# Altium schematic sheet AMPiso.SchDoc
size 420 x 297 mm; Address1: Address1; Address2: Address2; Address3: Address3; Address4: Address4; SheetNumber: 1; Scale: 1:1; Разраб.: Иванов; Обозначение документа: АБВГ.123456.001 Э3; Пров.: Петров; Утв.: Сидоров; Наименование организации: ОАО "Концерн "МПО-Гидроприбор"; Перв. применение: АБВГ.123456.000; Наименование изделия 1: Плата; Наименование изделия 2: Схема электрическая; Наименование изделия 3: принципиальная; Нач. отд.: Нач. отд.; Фамилия нач. отд.: Сидоров
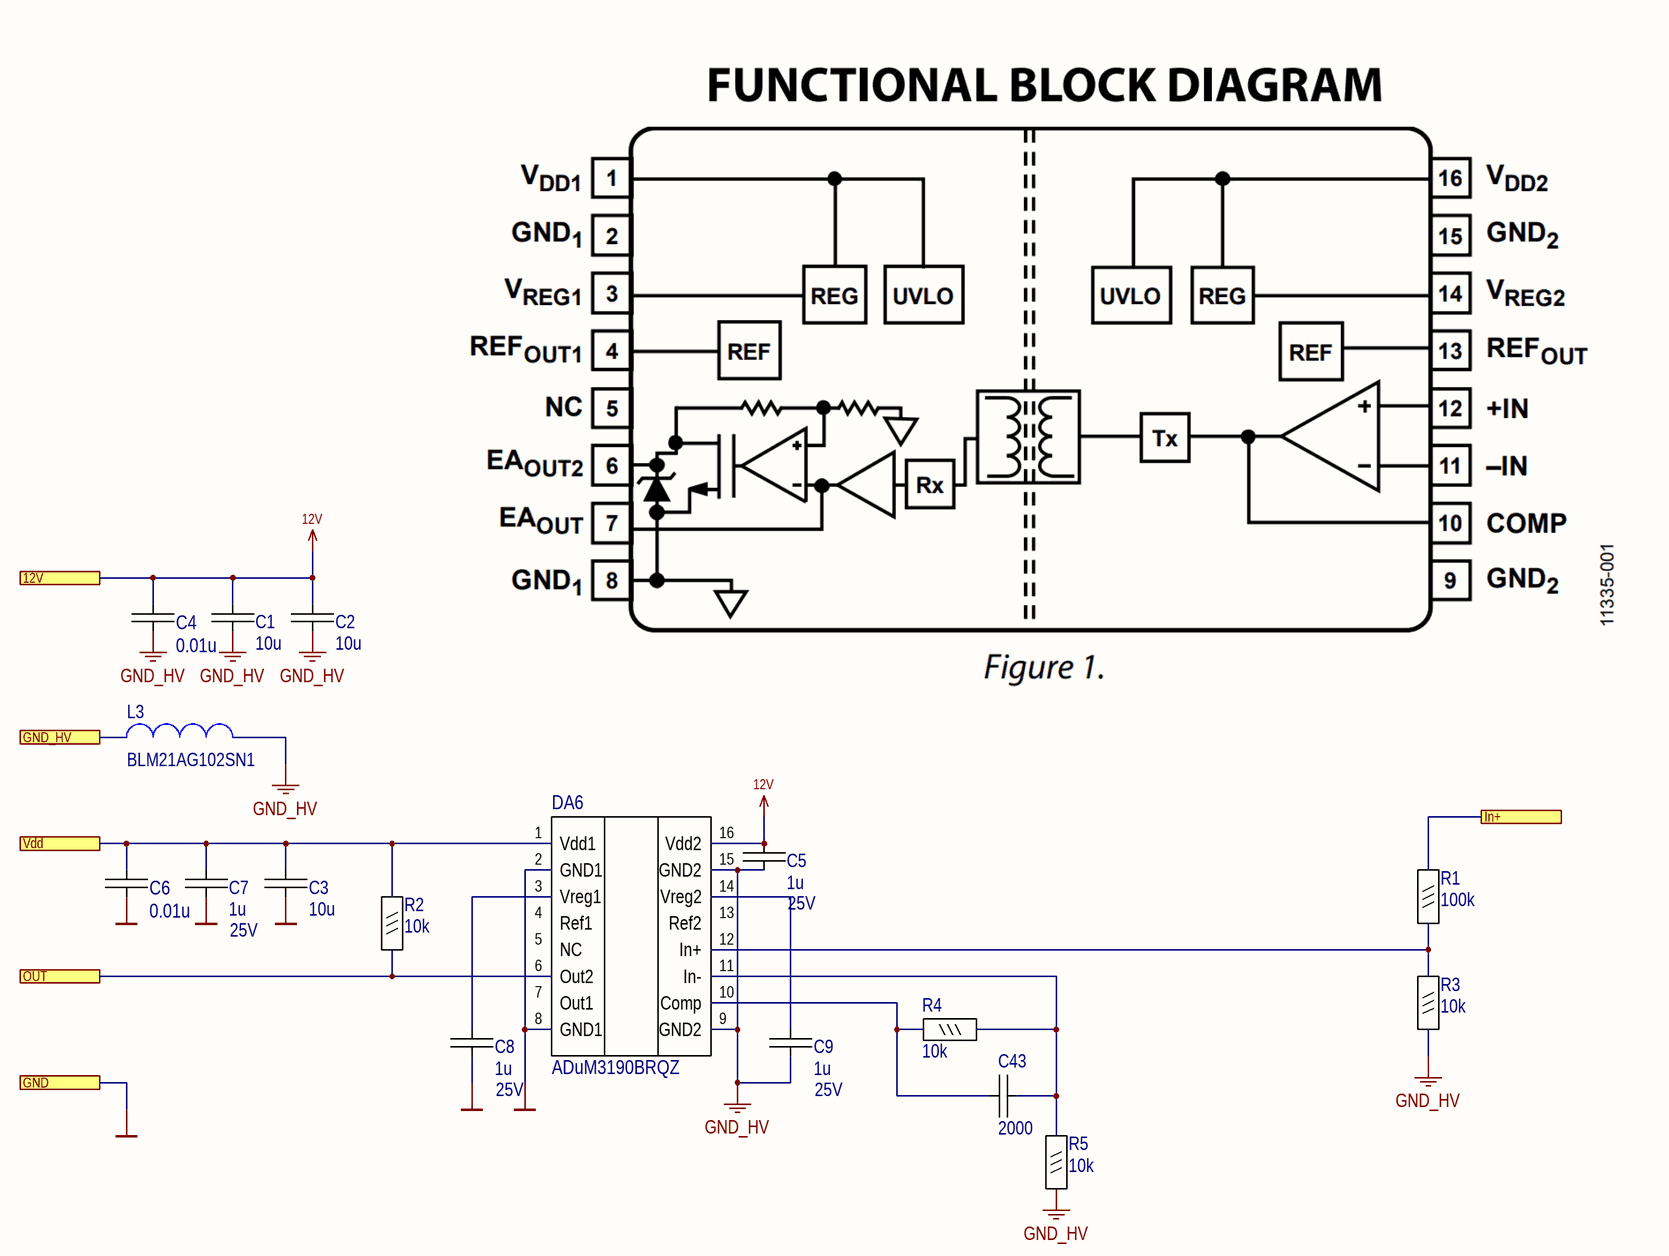
[diagram p0: AMPiso.SchDoc]

## Parts
C1  10u  [C0805_IPC]
C2  10u  [C0805_IPC]
C3  10u  [C0805_IPC]
C4  0.01u  [C0603_IPC]
C5  1u  Voltage/Power: 25V  [C0603_IPC]
C6  0.01u  [C0603_IPC]
C7  1u  Voltage/Power: 25V  [C0603_IPC]
C8  1u  Voltage/Power: 25V  [C0603_IPC]
C9  1u  Voltage/Power: 25V  [C0603_IPC]
C43  2000  [C0603_IPC]
DA6  ADuM3190BRQZ  [QSOP16]
L3  BLM21AG102SN1  [ind0805]
R1  100k  [R0603]
R2  10k  [R0603]
R3  10k  [R0603]
R4  10k  [R0603]
R5  10k  [R0603]

## Ports
12V, GND, GND_HV, In+, OUT, Vdd

## Nets
12V: C1.1 C2.1 C4.1 C5.1 DA6.16(Vdd2) ; port 12V
GND: C3.2 C6.2 C7.2 C8.2 DA6.2(GND1) DA6.8(GND1) ; port GND
GND_HV: C1.2 C2.2 C4.2 C5.2 C9.2 DA6.9(GND2) DA6.15(GND2) L3.2 R3.1 R5.1
GND_HV: L3.1 ; port GND_HV  [a separate net that carries the same name]
In+: R1.2 ; port In+
OUT: DA6.6(Out2) R2.1 ; port OUT
Vdd: C3.1 C6.1 C7.1 DA6.1(Vdd1) R2.2 ; port Vdd
NetC8_1: C8.1 DA6.3(Vreg1)
NetC9_1: C9.1 DA6.14(Vreg2)
NetC43_1: C43.1 DA6.10(Comp) R4.1
NetC43_2: C43.2 DA6.11(In-) R4.2 R5.2
NetDA6_12: DA6.12(In+) R1.1 R3.2

Not connected (* = marked no-connect by the designer): DA6 4(Ref1) 5(NC) 7(Out1) 13(Ref2)

## Notes on the sheet
- Подп. и дата
- Инв. № дубл.
- Взам. инв. №
- Инв. № подл.
- Изм.
- Лист
- № докум.
- Подп.
- Дата
- Копировал
- Формат А3

## Library data of the parts
C1-C3 = 10u 25V: 10µF ±10% 25V Ceramic Capacitor X5R 0805 (2012 Metric); MPN: CC0805KKX5R8BB106; Manufacturer: Yageo; Name: 10u 25V; Tolerance: 0,1; Value: 10u; Voltage/Power: 25V; LibraryPath: sch\cap.schlib; FootprintPath: pcb\capSmd.pcblib; ComponentLink2URL: https://www.digikey.com/products/en/capacitors/ceramic-capacitors/60?k=CC0805KKX5R8BB106&k=&pkeyword=CC0805KKX5R8BB106&sv=0&pv1989=0&sf=0&quantity=&ColumnSort=0&page=1&pageSize=25; ComponentLink2Description: site; Type: X5R; price elitan 1000pc: 4.18; price terra 1000pc: 4.5
C4 C6 = 0.01u 50V: 0.01uF ±10% 50V Ceramic Capacitor X7R 0603 (1608 Metric); MPN: CC0603KRX7R9BB103; Manufacturer: Yageo; Tolerance: 0,1; PartNumber: 0.01u 50V; Value: 0.01u; Voltage/Power: 50V; LibraryPath: _library\sch\cap.schlib; FootprintPath: _library\pcb\capSmd.pcblib; ComponentLink2URL: https://www.digikey.com/product-detail/en/yageo/CC0603KRX7R9BB103/311-1085-2-ND/302819; ComponentLink2Description: site; Type: X7R; price elitan 1000pc: 0.54; price terra 1000pc: 0.62
C5 C7-C9 = 1u 25V: 1µF ±10% 25V Ceramic Capacitor X7R 0603 (1608 Metric); MPN: CL10B105KA8NNNC; Manufacturer: Samsung; Name: 1u 25V; Tolerance: 0,1; LibraryPath: _library\sch\cap.schlib; FootprintPath: _library\pcb\capSmd.pcblib; ComponentLink2URL: https://www.digikey.com/product-detail/en/samsung-electro-mechanics/CL10B105KA8NNNC/1276-1184-2-ND/3886842; ComponentLink2Description: site; Type: X7R; price elitan 1000pc: 0.85; price terra 1000pc: 0.97; Value: 1u
C43 = 2000p 50V: 2000pF ±10% 50V Ceramic Capacitor X7R 0603 (1608 Metric); MPN: CC0603KRX7R9BB202; Manufacturer: Yageo; Tolerance: 0,1; Name: 2000p 50V; Value: 2000; Voltage/Power: 50V; LibraryPath: _library\sch\cap.schlib; FootprintPath: _library\pcb\capSmd.pcblib; ComponentLink2URL: https://www.digikey.com/product-detail/en/yageo/CC0603KRX7R9BB202/311-4098-2-ND/5883802; ComponentLink2Description: site; Type: X7R; price elitan 1000pc: 0.54; price terra 1000pc: 0.62
DA6 = ADUM3190B: 400kHz band width IC AMPLIFIER ISOLATED 16-QSOP; ComponentLink1Description: DataSheet; ComponentLink1URL: C:\DATASHEET\Driver\ADM2682E.pdf; Name: ADUM3190B; MPN: ADuM3190BRQZ; ComponentLink2URL: https://www.analog.com/media/en/technical-documentation/data-sheets/ADuM3190.pdf; ComponentLink2Description: site
L3 = BLM21AG102: 1 kOhms @ 100MHz 1 Ferrite Bead 0805 (2012 Metric) 500mA 280 mOhm; Manufacturer: Murata Electronics North America; Value: 20mH, 1 kOhms @ 100MHz; Tolerance: ±25%; MPN: BLM21AG102SN1; Name: BLM21AG102; Voltage/Power: 500mA 280 mOhm; LibraryPath: _library\sch\inductors.schlib; FootprintPath: _library\pcb\inductor.pcblib; ComponentLink2URL: https://www.digikey.com/product-detail/en/murata-electronics-north-america/BLM21AG102SN1D/490-1041-2-ND/468922; ComponentLink2Description: site; price elitan 1000pc: 2.08; price terra 1000pc: 3.3; price chipdip 1000pc: 6; price dart 1000pc: 1.49
R1 = 100k 1%: 100 kOhms ±1% 0.1W, 1/10W Chip Resistor 0603 (1608 Metric) Moisture Resistant Thick Film; MPN: RC0603FR-07100KL; Manufacturer: yageo; Name: 100k 1%; Voltage/Power: 0.063; Value: 100k; Tolerance: 1%; ComponentLink2URL: https://www.digikey.com/product-detail/en/yageo/RC0603FR-07100KL/311-100KHRTR-ND/726889; ComponentLink2Description: site; price elitan 1000pc: 0.19; price terra 1000pc: 0.22; LibraryPath: sch\res.Schlib; FootprintPath: pcb\resSmd.pcblib
R2 R3 = 10k 1%: 10 kOhms ±1% 0.1W, 1/10W Chip Resistor 0603 (1608 Metric) Moisture Resistant Thick Film; MPN: RC0603FR-0710KL; Manufacturer: yageo; Name: 10k 1%; Voltage/Power: 0.063; Value: 10k; Tolerance: 1%; ComponentLink2URL: https://www.digikey.com/product-detail/en/yageo/RC0603FR-0710KL/311-10.0KHRTR-ND/726880; ComponentLink2Description: site; price elitan 1000pc: 0.19; price terra 1000pc: 0.22; LibraryPath: sch\res.Schlib; FootprintPath: pcb\resSmd.pcblib
R4 R5 = 10k 5%: 10 kOhms ±5% 0.1W, 1/10W Chip Resistor 0603 (1608 Metric) Moisture Resistant Thick Film; MPN: RC0603JR-0710kL; Manufacturer: yageo; Name: 10k 5%; Voltage/Power: 0.063; Value: 10k; Tolerance: 5%; ComponentLink2URL: https://www.digikey.com/product-detail/en/yageo/RC0603JR-0710KL/311-10KGRTR-ND/726700; ComponentLink2Description: site; price elitan 1000pc: 0.17; price terra 1000pc: 0.15; LibraryPath: sch\res.schlib; FootprintPath: pcb\resSmd.pcblib